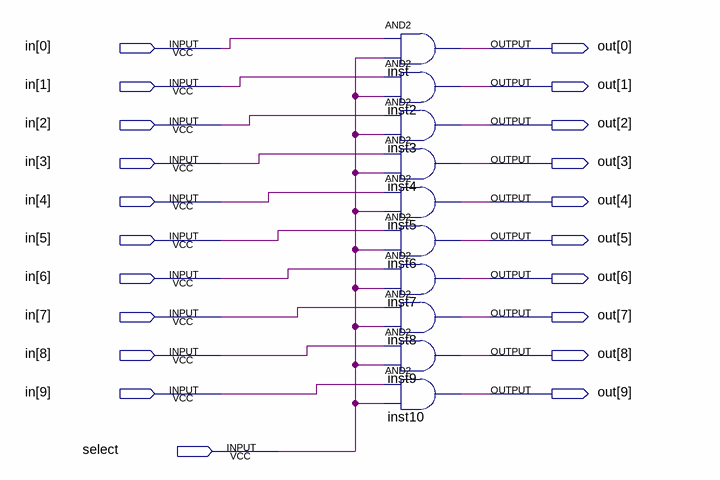
[diagram p0: schematic sheet]
// Quartus schematic tri10.bdf as structural Verilog: 10 symbols, 21 pins
module tri10 (
  input  [9:0] in,
  input  select,
  output [9:0] out
);

  and inst (out[0], in[0], select);
  and inst2 (out[1], in[1], select);
  and inst3 (out[2], in[2], select);
  and inst4 (out[3], in[3], select);
  and inst5 (out[4], in[4], select);
  and inst6 (out[5], in[5], select);
  and inst7 (out[6], in[6], select);
  and inst8 (out[7], in[7], select);
  and inst9 (out[8], in[8], select);
  and inst10 (out[9], in[9], select);
endmodule
